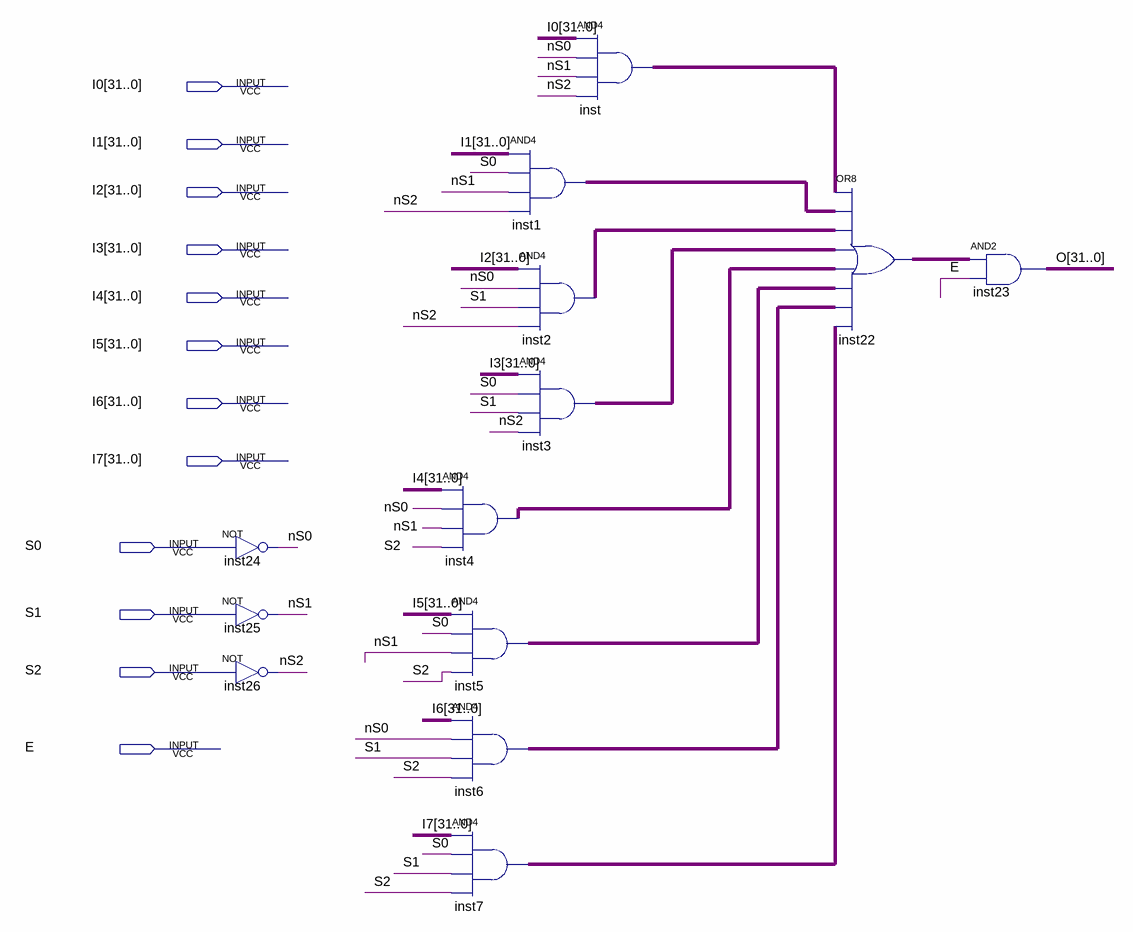
[diagram p0: schematic sheet]
// Quartus schematic MUX8_32.bdf as structural Verilog: 13 symbols, 12 pins
module MUX8_32 (
  input  [31:0] I0,
  input  [31:0] I1,
  input  [31:0] I2,
  input  [31:0] I3,
  input  [31:0] I4,
  input  [31:0] I5,
  input  [31:0] I6,
  input  [31:0] I7,
  input  S0,
  input  S1,
  input  S2,
  input  E
);

  wire nS0, nS1, nS2;
  wire [31:0] inst1_out, inst2_out, inst3_out, inst4_out, inst5_out, inst6_out, inst7_out, inst22_out,
       inst_out, O;

  not inst24 (nS0, S0);
  not inst25 (nS1, S1);
  not inst26 (nS2, S2);
  assign inst4_out = I4 & {32{nS0}} & {32{nS1}} & {32{S2}};  // AND4 inst4, 32 bits wide
  assign inst5_out = I5 & {32{S0}} & {32{nS1}} & {32{S2}};  // AND4 inst5, 32 bits wide
  assign inst6_out = I6 & {32{nS0}} & {32{S1}} & {32{S2}};  // AND4 inst6, 32 bits wide
  assign inst7_out = I7 & {32{S0}} & {32{S1}} & {32{S2}};  // AND4 inst7, 32 bits wide
  assign inst1_out = I1 & {32{S0}} & {32{nS1}} & {32{nS2}};  // AND4 inst1, 32 bits wide
  assign inst2_out = I2 & {32{nS0}} & {32{S1}} & {32{nS2}};  // AND4 inst2, 32 bits wide
  assign inst3_out = I3 & {32{S0}} & {32{S1}} & {32{nS2}};  // AND4 inst3, 32 bits wide
  assign inst_out = I0 & {32{nS0}} & {32{nS1}} & {32{nS2}};  // AND4 inst, 32 bits wide
  assign inst22_out = inst_out | inst1_out | inst2_out | inst3_out | inst4_out | inst5_out | inst6_out | inst7_out;  // OR8 inst22, 32 bits wide
  assign O = inst22_out & {32{E}};  // AND2 inst23, 32 bits wide
endmodule
